# EasyEDA schematic Schematic_Booster GPS-EasyEDA.json
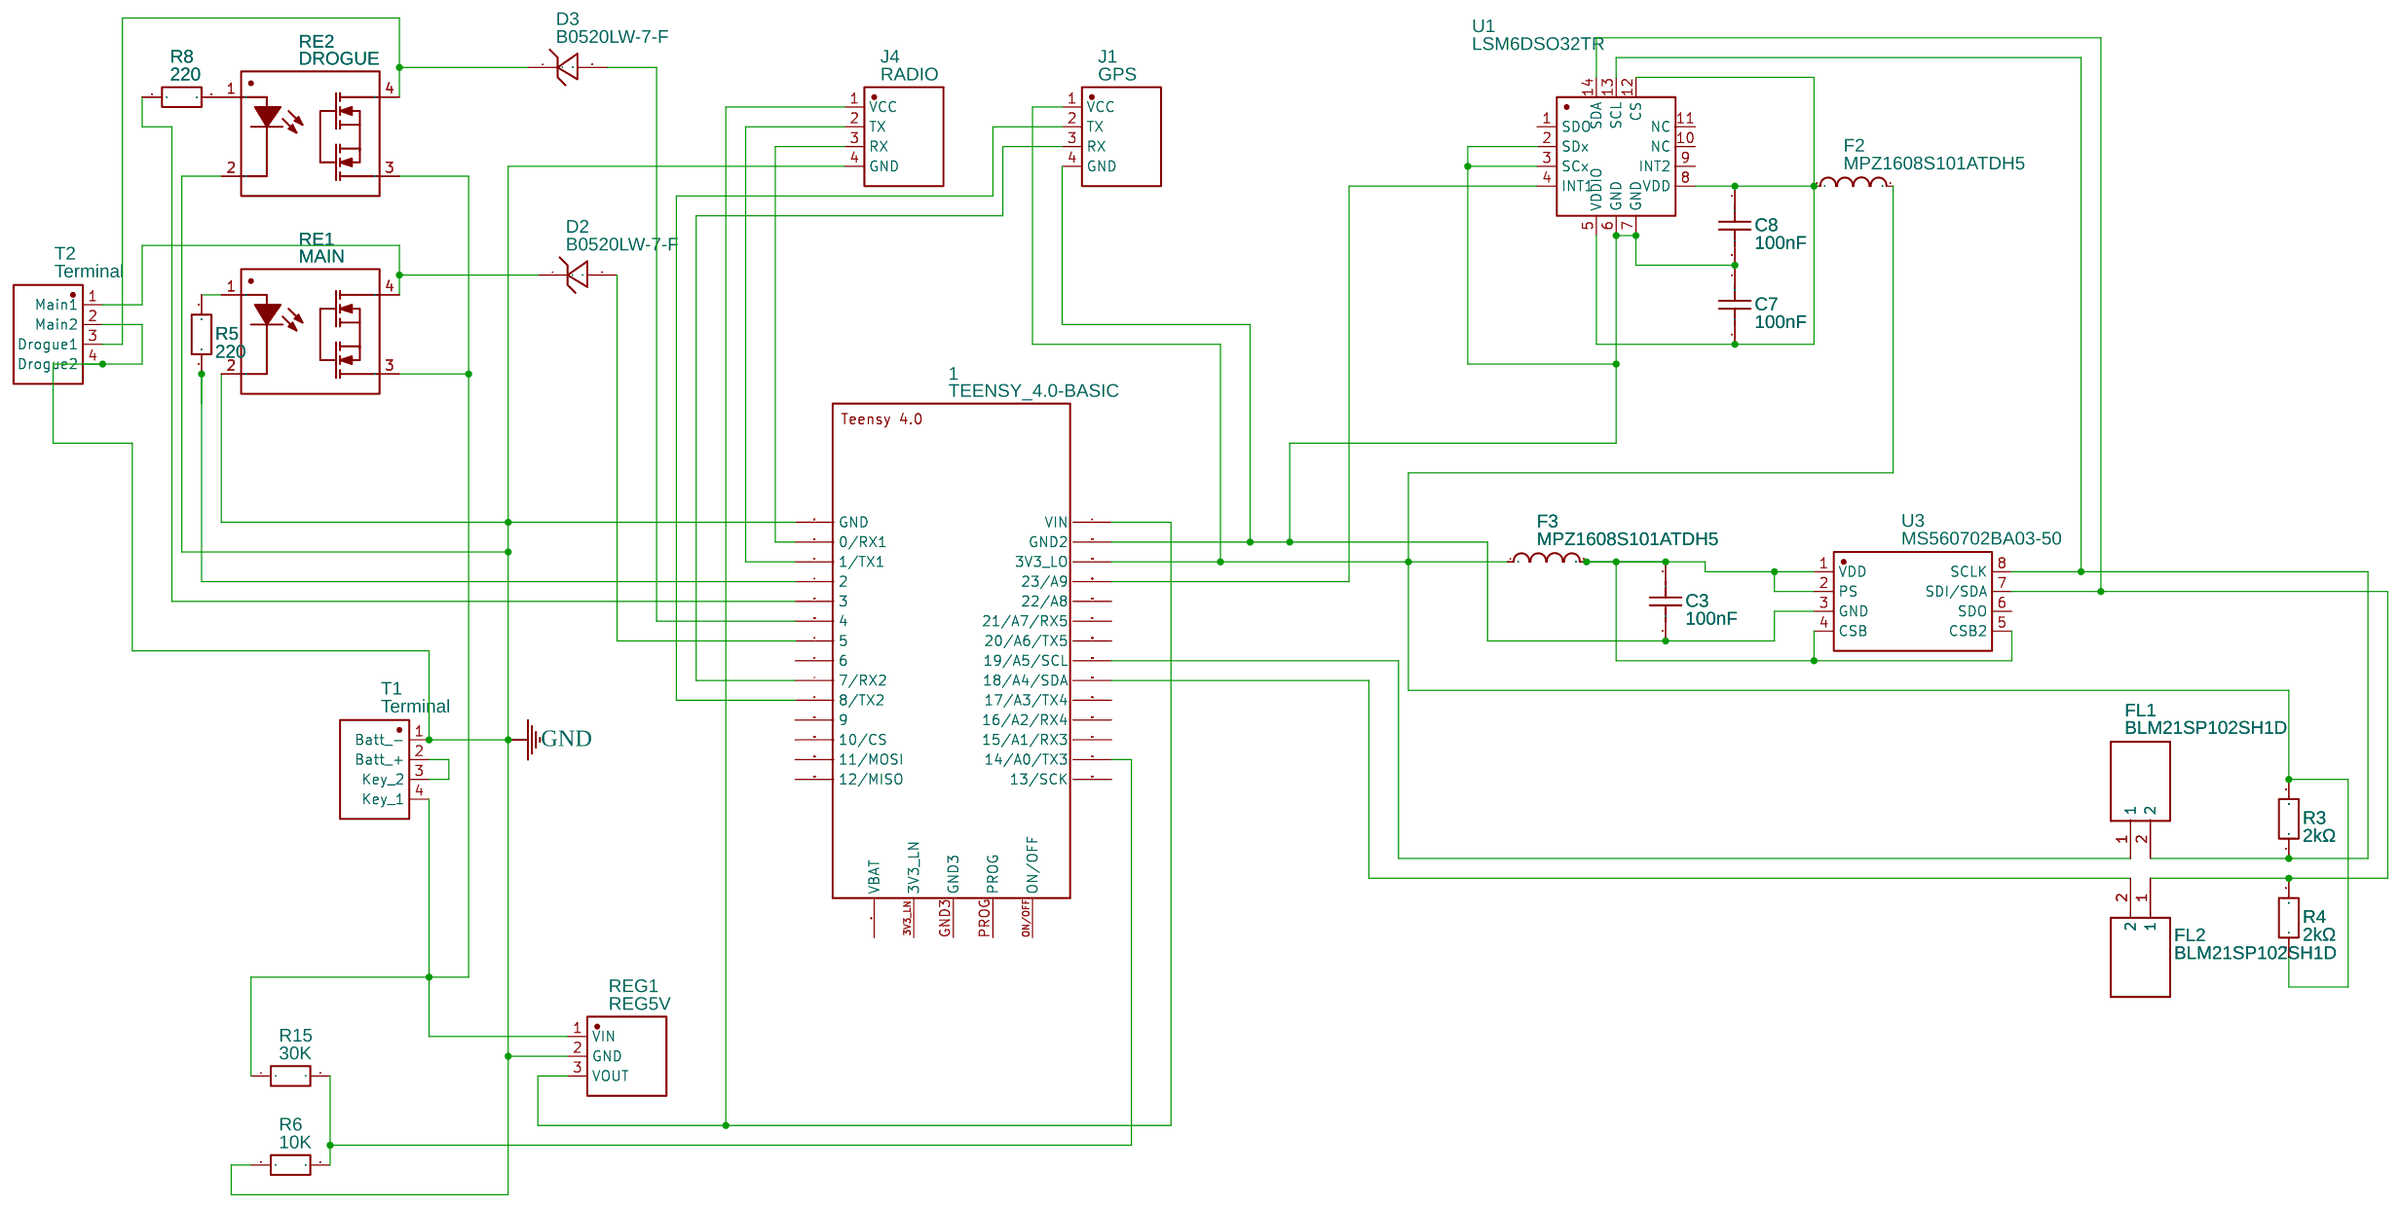
[diagram p0: schematic sheet]

## Parts
1  TEENSY_4.0-BASIC  [TEENSY_4.0-BASIC]
C3  100nF  [C0402]
C7  100nF  [C0402]
C8  100nF  [C0402]
D2  B0520LW-7-F  [SOD-123FL_L2.7-W1.8-LS3.8-RD]
D3  B0520LW-7-F  [SOD-123FL_L2.7-W1.8-LS3.8-RD]
F2  MPZ1608S101ATDH5  [L0603]
F3  MPZ1608S101ATDH5  [L0603]
FL1  BLM21SP102SH1D  [BLM21AG102BH1J]
FL2  BLM21SP102SH1D  [BLM21AG102BH1J]
J1  GPS  [B4B-PH-K(LF)(SN)]
J4  RADIO  [B4B-PH-K(LF)(SN)]
R3  2kΩ  [R0805]
R4  2kΩ  [R0805]
R5  220  [R0805]
R6  10K  [R0805]
R8  220  [R0805]
R15  30K  [R0805]
RE1  MAIN  [DIP-4_L6.4-W4.6-P2.54-LS7.6-BL]
RE2  DROGUE  [DIP-4_L6.4-W4.6-P2.54-LS7.6-BL]
REG1  REG5V  [REG5PCB]
T1  Terminal  [TERMINAL4B]
T2  Terminal  [TERMINAL4B]
U1  LSM6DSO32TR  [LGA-14L-MB]
U3  MS560702BA03-50  [SENSOR-SMD_MS560702BA03-50]

## Library data of the parts
1 = TEENSY_4.0-BASIC: Contributor: Saksham Bhutani
C3 C7 C8 = CC0402KRX7R6BB104: Supplier: LCSC; Supplier Part: C309458; Manufacturer: YAGEO; Contributor: LCSC; SMT Type: Extend; JLCPCB SMD: Yes; LCSC Assembly: Yes; Paste Type: expand
D2 D3 = B0520LW-7-F: Supplier: LCSC; Supplier Part: C155367; Manufacturer: Diodes Incorporated; Contributor: LCSC; SMT Type: Extend; JLCPCB SMD: Yes; LCSC Assembly: Yes; Paste Type: expand
F2 F3 = MPZ1608S101ATDH5: Supplier: LCSC; Supplier Part: C307769; Manufacturer: TDK; Contributor: LCSC
FL1 FL2 = BLM21SP102SH1D: Contributor: Jonas_IM2M
J1 J4 = -: Supplier: LCSC; Supplier Part: C265289; Manufacturer: JST Sales America; Contributor: LCSC
R3 R4 = ERA6AEB202V: Supplier: LCSC; Supplier Part: C417117; Manufacturer: PANASONIC; Contributor: LCSC
R5 R6 R8 R15 = ERJP06J221V: Supplier: LCSC; Supplier Part: C417010; Manufacturer: PANASONIC; Contributor: LCSC
RE1 RE2 = AQY210EH: Supplier: LCSC; Manufacturer: PANASONIC; Supplier Part: C13541
REG1 = -: Contributor: mbrinker
T1 T2 = Terminal4b: Contributor: mbrinker
U1 = LSM6DSO32TR: Manufacturer: STMicroelectronics; Supplier: Digi-Key; Supplier Part: 497-LSM6DSO32TR-ND; link: https://www.st.com/en/mems-and-sensors/lsm6dso32.html#resource; Contributor: joar.gjersund
U3 = MS560702BA03-50: Supplier: LCSC; Supplier Part: C97627; Manufacturer: TE Connectivity; Contributor: LCSC

## Nets
GND: 1.GND J4.4(GND) R6.1 RE1.2(K) RE2.2(K) REG1.2(GND) T1.1(Batt -) T2.2(Main2) T2.4(Drogue2)
Net-(1-0/RX): 1.0/RX(0/RX1) J4.3(RX)
Net-(1-1/TX): 1.1/TX(1/TX1) J4.2(TX)
Net-(1-2): 1.2 R5.1
Net-(1-3/CANTX): 1.3/CANTX(3) R8.1
Net-(1-3V3_LO): 1.3V3_LO F2.2 F3.1 J1.1(VCC) R3.2 R4.1
Net-(1-4/CANRX): 1.4/CANRX(4) D3.2
Net-(1-5): 1.5 D2.2
Net-(1-7): 1.7(7/RX2) J1.3(RX)
Net-(1-8): 1.8(8/TX2) J1.2(TX)
Net-(1-14/A0): 1.14/A0(14/A0/TX3) R6.2 R15.2
Net-(1-18/A4/SDA): 1.18/A4/SDA FL2.2
Net-(1-19/A5/SCL): 1.19/A5/SCL FL1.1
Net-(1-23/A9): 1.23/A9 U1.4(INT1)
Net-(1-GND2): 1.GND2 C3.1 C7.1 C8.2 J1.4(GND) U1.2(SDx) U1.3(SCx) U1.6(GND) U1.7(GND) U3.3(GND)
Net-(1-VIN): 1.VIN J4.1(VCC) REG1.3(VOUT)
Net-(C3-2): C3.2 F3.2 U3.1(VDD) U3.2(PS) U3.4(CSB) U3.5(CSB2)
Net-(C7-2): C7.2 C8.1 F2.1 U1.5(VDDIO) U1.8(VDD) U1.12(CS)
Net-(D2-1): D2.1 RE1.4 T2.1(Main1)
Net-(D3-1): D3.1 RE2.4 T2.3(Drogue1)
Net-(FL1-2): FL1.2 R3.1 U1.13(SCL) U3.8(SCLK)
Net-(FL2-1): FL2.1 R4.2 U1.14(SDA) U3.7(SDI/SDA)
Net-(R5-2): R5.2 RE1.1
Net-(R8-2): R8.2 RE2.1
Net-(R15-1): R15.1 RE1.3 RE2.3 REG1.1(VIN) T1.4(Key 1)
Net-(T1-2): T1.2(Batt +) T1.3(Key 2)

Not connected (* = marked no-connect by the designer): 1 3V3_LN 6 9/CS(9) 10/CS 11/MOSI 12/MISO 13/SCK 15/A1(15/A1/RX3) 16/A2(16/A2/RX4) 17/A3(17/A3/TX4) 20/A6(20/A6/TX5) 21/A7(21/A7/RX5) 22/A8 GND3 ON/OFF PROG VBAT\(VBAT); U1 1(SDO) 9(INT2) 10(NC) 11(NC); U3 6(SDO)
